# Altium schematic sheet FRB_Simconex.SchDoc
size A4
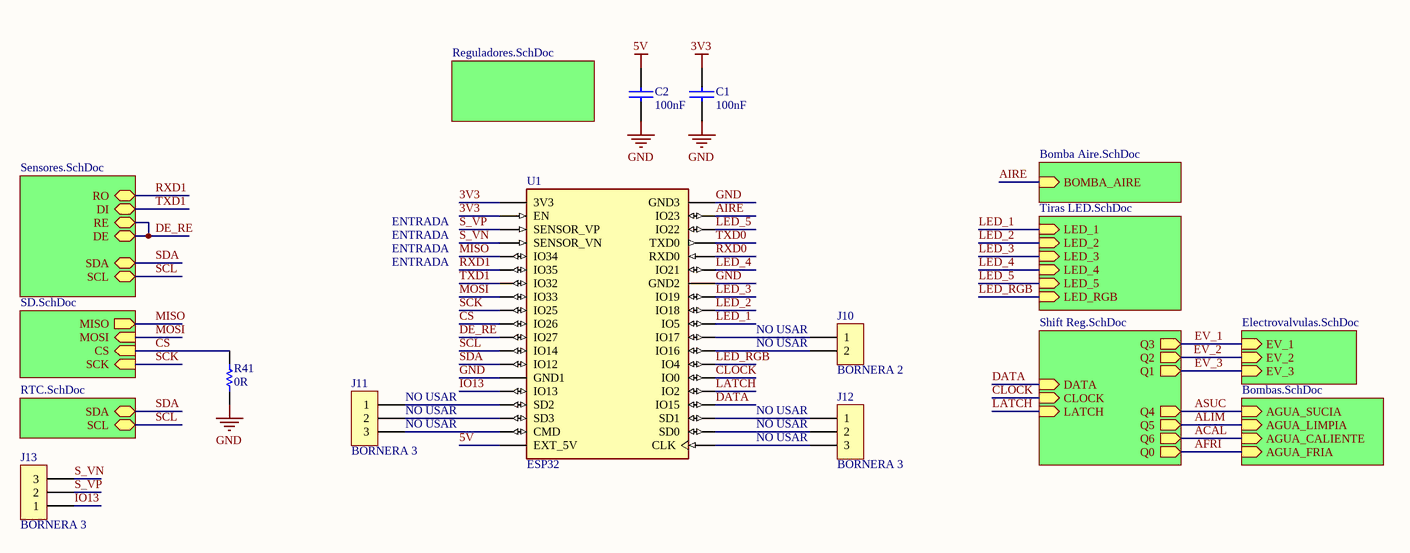
[diagram p0: FRB_Simconex.SchDoc]

## Parts
C1  100nF  [0805]
C2  100nF  [0805]
J10  BORNERA 2  [BORNERA2]
J11  BORNERA 3  [BORNERA3]
J12  BORNERA 3  [BORNERA3]
J13  BORNERA 3  [BORNERA3]
R41  0R  [0805]
U1  ESP32  [ESP32]

## Sub-sheets
Designator = Tiras LED.SchDoc: LED_3 (in), LED_2 (in), LED_5 (in), LED_1 (in), LED_4 (in), LED_RGB (in)
Designator = Sensores.SchDoc: SDA (bidir), SCL (bidir), DI (bidir), RO (bidir), DE (bidir), RE (bidir)
Designator = Reguladores.SchDoc: no entries
Designator = Electrovalvulas.SchDoc: EV_1 (in), EV_2 (in), EV_3 (in)
Designator = Bombas.SchDoc: AGUA_SUCIA (in), AGUA_LIMPIA (in), AGUA_CALIENTE (in), AGUA_FRIA (in)
Designator = Bomba Aire.SchDoc: BOMBA_AIRE (in)
Designator = SD.SchDoc: CS (in), MOSI (in), SCK (in), MISO (out)
Designator = RTC.SchDoc: SDA (bidir), SCL (bidir)
Designator = Shift Reg.SchDoc: CLOCK (in), LATCH (in), DATA (in), Q3 (out), Q0 (out), Q5 (out), Q2 (out), Q4 (out), Q1 (out), Q6 (out)

## Nets
3V3: C1.1 U1.J2-1(3V3) U1.J2-2(EN)
5V: C2.1 U1.J2-19(EXT_5V)
GND: C1.2 C2.2 R41.1 U1.J2-14(GND1) U1.J3-1(GND3) U1.J3-7(GND2)
ACAL: sheet Designator/AGUA_CALIENTE, sheet Designator/Q6
AFRI: sheet Designator/AGUA_FRIA, sheet Designator/Q0
AIRE: U1.J3-2(IO23) ; sheet Designator/BOMBA_AIRE
ALIM: sheet Designator/AGUA_LIMPIA, sheet Designator/Q5
ASUC: sheet Designator/AGUA_SUCIA, sheet Designator/Q4
CLOCK: U1.J3-14(IO0) ; sheet Designator/CLOCK
CS: R41.2 U1.J2-10(IO26) ; sheet Designator/CS
DATA: U1.J3-16(IO15) ; sheet Designator/DATA
DE_RE: U1.J2-11(IO27) ; sheet Designator/DE, sheet Designator/RE
EV_1: sheet Designator/EV_1, sheet Designator/Q3
EV_2: sheet Designator/EV_2, sheet Designator/Q2
EV_3: sheet Designator/EV_3, sheet Designator/Q1
IO13: J13.1 U1.J2-15(IO13)
LATCH: U1.J3-15(IO2) ; sheet Designator/LATCH
LED_1: U1.J3-10(IO5) ; sheet Designator/LED_1
LED_2: U1.J3-9(IO18) ; sheet Designator/LED_2
LED_3: U1.J3-8(IO19) ; sheet Designator/LED_3
LED_4: U1.J3-6(IO21) ; sheet Designator/LED_4
LED_5: U1.J3-3(IO22) ; sheet Designator/LED_5
LED_RGB: U1.J3-13(IO4) ; sheet Designator/LED_RGB
MISO: U1.J2-5(IO34) ; sheet Designator/MISO
MOSI: U1.J2-8(IO33) ; sheet Designator/MOSI
RXD0: U1.J3-5(RXD0)
RXD1: U1.J2-6(IO35) ; sheet Designator/RO
S_VN: J13.3 U1.J2-4(SENSOR_VN)
S_VP: J13.2 U1.J2-3(SENSOR_VP)
SCK: U1.J2-9(IO25) ; sheet Designator/SCK
SCL: U1.J2-12(IO14) ; sheet Designator/SCL, sheet Designator/SCL
SDA: U1.J2-13(IO12) ; sheet Designator/SDA, sheet Designator/SDA
TXD0: U1.J3-4(TXD0)
TXD1: U1.J2-7(IO32) ; sheet Designator/DI
NetJ10_1: J10.1 U1.J3-11(IO17)
NetJ10_2: J10.2 U1.J3-12(IO16)
NetJ11_1: J11.1 U1.J2-16(SD2)
NetJ11_2: J11.2 U1.J2-17(SD3)
NetJ11_3: J11.3 U1.J2-18(CMD)
NetJ12_1: J12.1 U1.J3-17(SD1)
NetJ12_2: J12.2 U1.J3-18(SD0)
NetJ12_3: J12.3 U1.J3-19(CLK)

## Notes on the sheet
- ENTRADA
- (near J10) NO USAR
- (near J11) NO USAR
- (near J12) NO USAR

## Library data of the parts
C1 C2 = CAP
R41 = RES